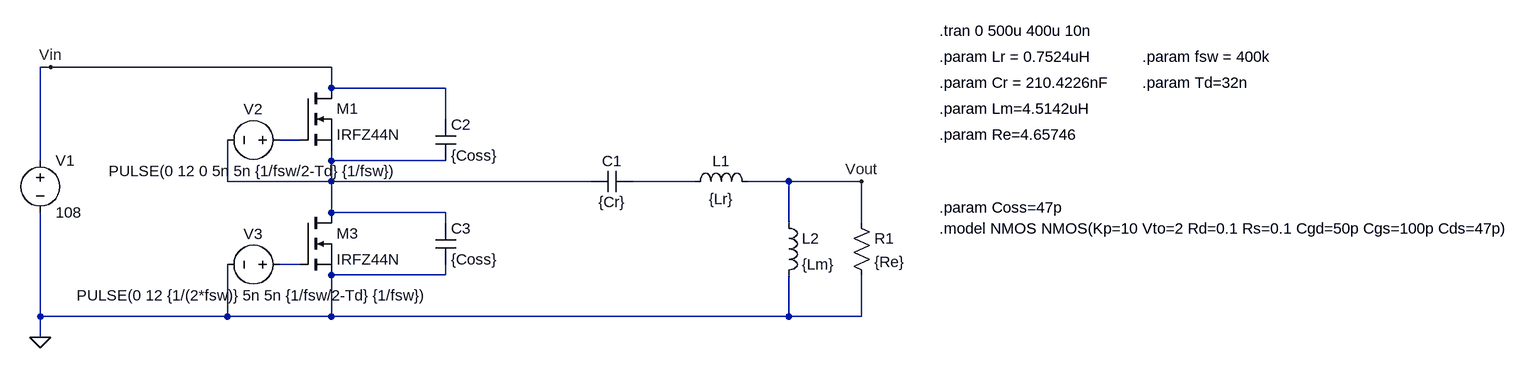
[diagram p0: schematic Half Bridge and Resonant Tank ZVS.asc]
Half Bridge and Resonant Tank ZVS.asc, the LTspice schematic file:
Version 4.1
SHEET 1 1740 680
WIRE -576 -96 -592 -96
WIRE -144 -96 -576 -96
WIRE -144 -64 -144 -96
WIRE 32 -64 -144 -64
WIRE 32 -16 32 -64
WIRE -192 16 -224 16
WIRE -592 48 -592 -96
WIRE -144 48 -144 32
WIRE 32 48 -144 48
WIRE -304 80 -304 16
WIRE -144 80 -144 48
WIRE -144 80 -304 80
WIRE 256 80 -144 80
WIRE 416 80 320 80
WIRE 560 80 496 80
WIRE 672 80 560 80
WIRE -144 128 -144 80
WIRE 32 128 -144 128
WIRE 32 144 32 128
WIRE 560 144 560 80
WIRE 672 144 672 80
WIRE -192 208 -224 208
WIRE 32 224 32 208
WIRE 32 224 -144 224
WIRE -592 288 -592 128
WIRE -304 288 -304 208
WIRE -304 288 -592 288
WIRE -144 288 -144 224
WIRE -144 288 -304 288
WIRE 560 288 560 224
WIRE 560 288 -144 288
WIRE 672 288 672 224
WIRE 672 288 560 288
WIRE -592 320 -592 288
FLAG 672 80 Vout
FLAG -576 -96 Vin
FLAG -592 320 0
SYMBOL cap 320 64 R90
WINDOW 0 0 32 VBottom 2
WINDOW 3 32 32 VTop 2
SYMATTR InstName C1
SYMATTR Value {Cr}
SYMBOL ind 400 96 R270
WINDOW 0 32 56 VTop 2
WINDOW 3 5 56 VBottom 2
SYMATTR InstName L1
SYMATTR Value {Lr}
SYMATTR SpiceLine Rser=1m
SYMBOL ind 544 128 R0
SYMATTR InstName L2
SYMATTR Value {Lm}
SYMATTR SpiceLine Rser=1m
SYMBOL res 656 128 R0
SYMATTR InstName R1
SYMATTR Value {Re}
SYMBOL nmos -192 -64 R0
SYMATTR InstName M1
SYMATTR Value IRFZ44N
SYMBOL cap 16 -16 R0
SYMATTR InstName C2
SYMATTR Value {Coss}
SYMBOL cap 16 144 R0
SYMATTR InstName C3
SYMATTR Value {Coss}
SYMBOL voltage -592 32 R0
WINDOW 123 0 0 Left 0
WINDOW 39 0 0 Left 0
SYMATTR InstName V1
SYMATTR Value 108
SYMBOL voltage -208 16 R90
WINDOW 0 -32 56 VBottom 2
WINDOW 3 32 56 VTop 2
WINDOW 123 0 0 Left 0
WINDOW 39 0 0 Left 0
SYMATTR InstName V2
SYMATTR Value PULSE(0 12 0 5n 5n {1/fsw/2-Td} {1/fsw})
SYMBOL voltage -208 208 R90
WINDOW 0 -32 56 VBottom 2
WINDOW 3 32 56 VTop 2
WINDOW 123 0 0 Left 0
WINDOW 39 0 0 Left 0
SYMATTR InstName V3
SYMATTR Value PULSE(0 12 {1/(2*fsw)} 5n 5n {1/fsw/2-Td} {1/fsw})
SYMBOL nmos -192 128 R0
SYMATTR InstName M3
SYMATTR Value IRFZ44N
TEXT 792 -112 Left 2 !.param Lr = 0.7524uH
TEXT 792 -72 Left 2 !.param Cr = 210.4226nF
TEXT 792 -32 Left 2 !.param Lm=4.5142uH
TEXT 792 8 Left 2 !.param Re=4.65746
TEXT 792 120 Left 2 !.param Coss=47p
TEXT 1104 -112 Left 2 !.param fsw = 400k
TEXT 792 -152 Left 2 !.tran 0 500u 400u 10n
TEXT 1104 -72 Left 2 !.param Td=32n
TEXT 792 152 Left 2 !.model NMOS NMOS(Kp=10 Vto=2 Rd=0.1 Rs=0.1 Cgd=50p Cgs=100p Cds=47p)

The netlist it stands for:
* Half Bridge and Resonant Tank ZVS.asc
C1 N003 N002 {Cr}
L1 N003 Vout {Lr} Rser=1m
L2 Vout 0 {Lm} Rser=1m
R1 Vout 0 {Re}
M1 Vin N001 N002 N002 IRFZ44N
C2 Vin N002 {Coss}
C3 N002 0 {Coss}
V1 Vin 0 108
V2 N001 N002 PULSE(0 12 0 5n 5n {1/fsw/2-Td} {1/fsw})
V3 N004 0 PULSE(0 12 {1/(2*fsw)} 5n 5n {1/fsw/2-Td} {1/fsw})
M3 N002 N004 0 0 IRFZ44N
.model NMOS NMOS
.model PMOS PMOS
.lib standard.mos
.param Lr = 0.7524uH
.param Cr = 210.4226nF
.param Lm=4.5142uH
.param Re=4.65746
.param Coss=47p
.param fsw = 400k
.tran 0 500u 400u 10n
.param Td=32n
.model NMOS NMOS(Kp=10 Vto=2 Rd=0.1 Rs=0.1 Cgd=50p Cgs=100p Cds=47p)
.backanno
.end